# EAGLE design tetris_fs (EAGLE 8.3.2)
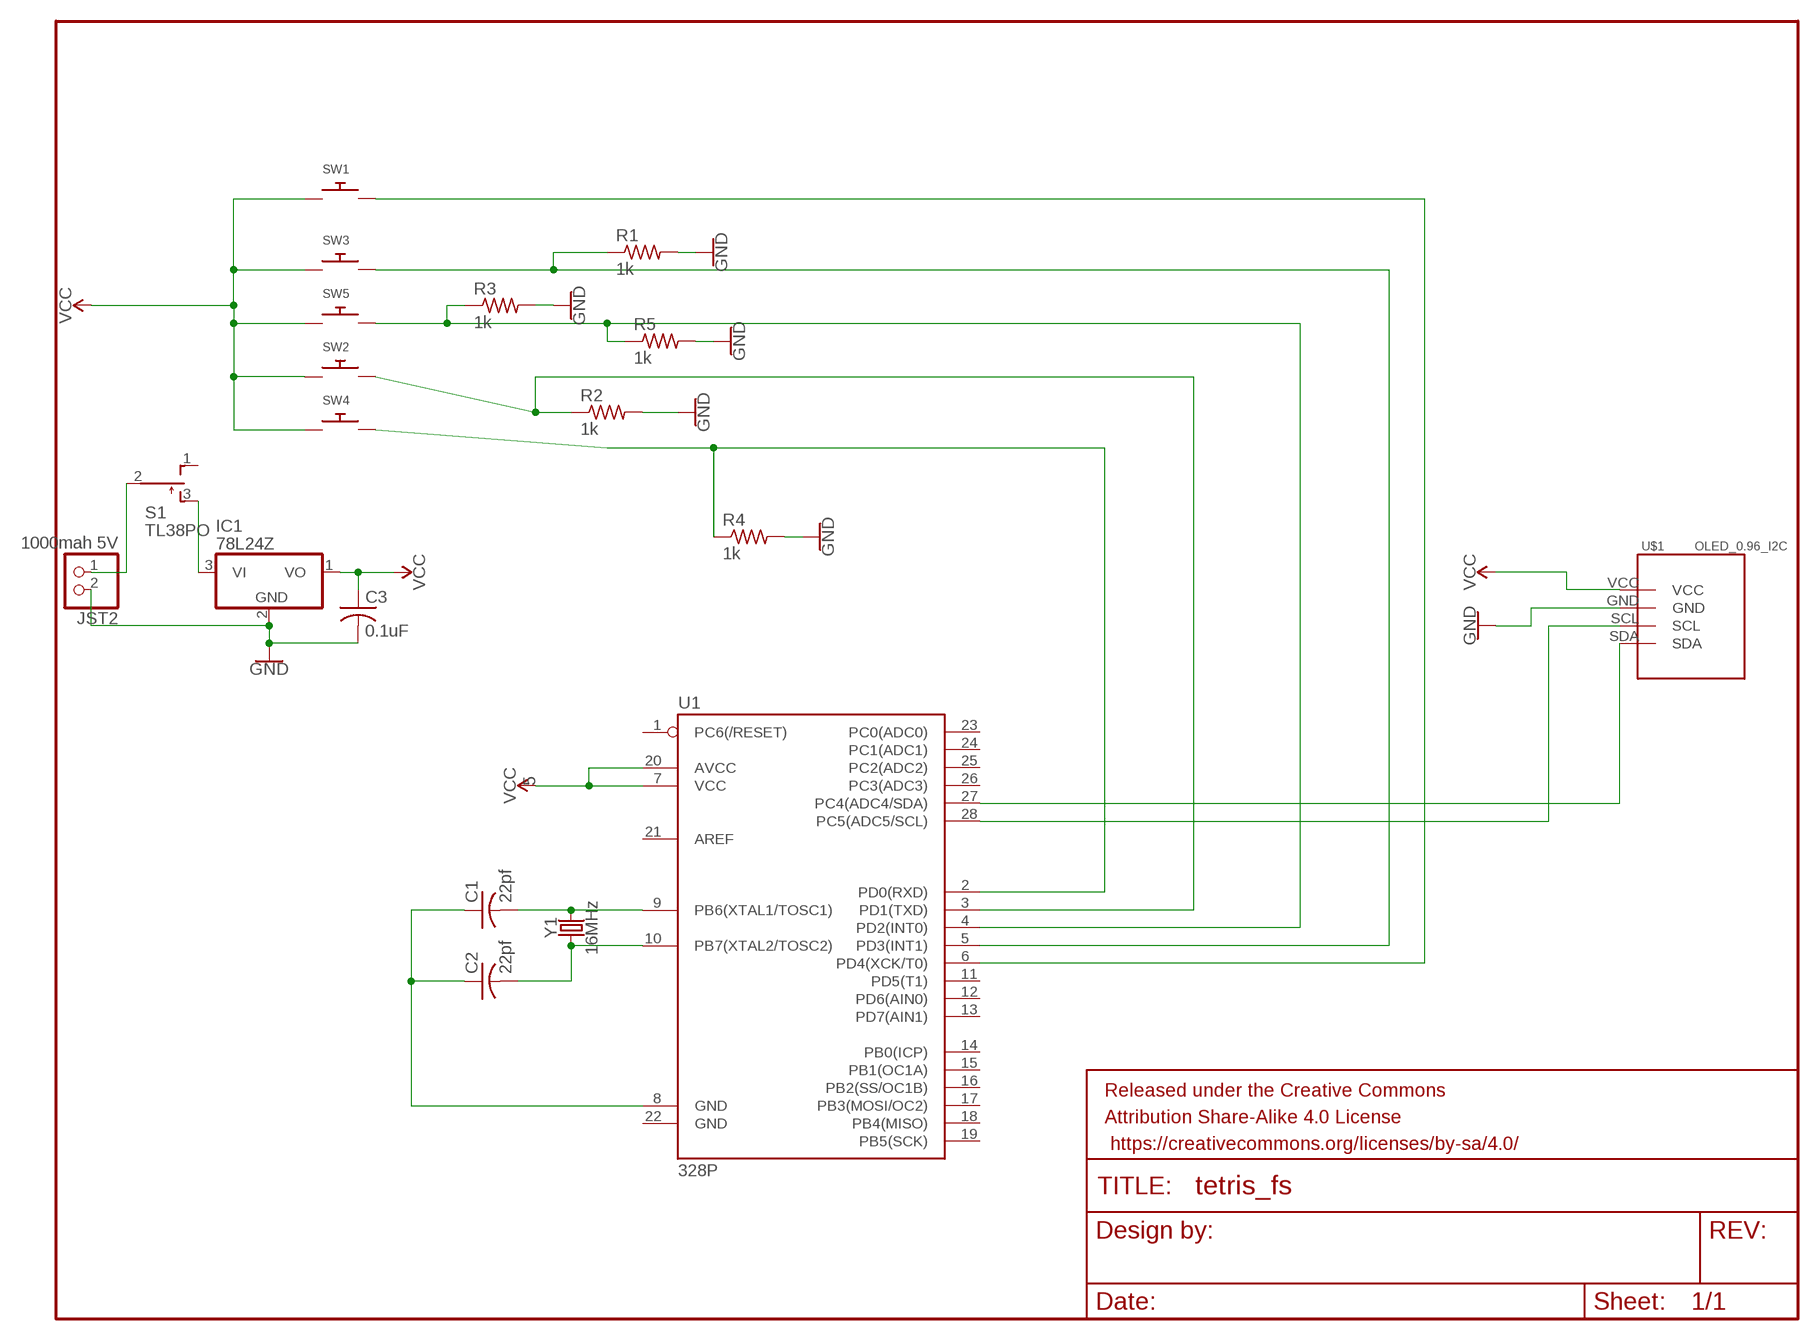
[diagram p0: schematic, sheet 1]

## Parts
C1  22pf  C-US050-030X075  [C050-030X075]
C2  22pf  C-US050-030X075  [C050-030X075]
C3  0.1uF  C-US050-030X075  [C050-030X075]
FRAME1  FRAME-LETTERNO_PACKAGE  [DUMMY]
IC1  78L24Z  [TO92]
JST2  1000mah 5V  JST_2PIN-SMT-RA  [JST-PH-2-SMT-RA]
R1  1k  R-US_FLIPFLOP  [0805-THM]
R2  1k  R-US_FLIPFLOP  [0805-THM]
R3  1k  R-US_FLIPFLOP  [0805-THM]
R4  1k  R-US_FLIPFLOP  [0805-THM]
R5  1k  R-US_FLIPFLOP  [0805-THM]
S1  TL38PO  [TL3XPO]
SW1  SWITCH_PUSHBUTTONC&K_KSS  [BTN_CK_KSS]
SW2  SWITCH_PUSHBUTTONC&K_KSS  [BTN_CK_KSS]
SW3  SWITCH_PUSHBUTTONC&K_KSS  [BTN_CK_KSS]
SW4  SWITCH_PUSHBUTTONC&K_KSS  [BTN_CK_KSS]
SW5  SWITCH_PUSHBUTTONC&K_KSS  [BTN_CK_KSS]
U1  328P  ATMEGA328P_PDIP  [DIP28]
U$1  OLED_0.96_I2C  [OLED_0.96_I2C]
Y1  16MHz  CRYSTAL-16MHZPTH-HC49US  [HC49US]

## Nets
GND: C3.2 IC1.2(GND) JST2.2 R1.2 R2.2 R3.2 R4.2 R5.2 U$1.GND
N$1: SW1.P$2 U1.6(PD4(XCK/T0))
N$2: R1.1 SW3.P$2 U1.5(PD3(INT1))
N$3: R3.1 R5.1 SW5.P$2 U1.4(PD2(INT0))
N$4: R2.1 SW2.P$2 U1.3(PD1(TXD))
N$5: R4.1 SW4.P$2 U1.2(PD0(RXD))
N$6: C1.2 U1.9(PB6(XTAL1/TOSC1)) Y1.2
N$7: C2.2 U1.10(PB7(XTAL2/TOSC2)) Y1.1
N$8: C1.1 C2.1 U1.8(GND)
N$9: JST2.1 S1.2(P)
N$10: U1.27(PC4(ADC4/SDA)) U$1.SDA
N$11: U1.28(PC5(ADC5/SCL)) U$1.SCL
N$12: IC1.3(VI) S1.3(S)
VCC: C3.1 IC1.1(VO) SW1.P$1 SW2.P$1 SW3.P$1 SW4.P$1 SW5.P$1 U1.7(VCC) U1.20(AVCC) U$1.VCC
Unconnected: S1.1(O) U1.1(PC6(/RESET)) U1.11(PD5(T1)) U1.12(PD6(AIN0)) U1.13(PD7(AIN1)) U1.14(PB0(ICP)) U1.15(PB1(OC1A)) U1.16(PB2(SS/OC1B)) U1.17(PB3(MOSI/OC2)) U1.18(PB4(MISO)) U1.19(PB5(SCK)) U1.21(AREF) U1.22(GND) U1.23(PC0(ADC0)) U1.24(PC1(ADC1)) U1.25(PC2(ADC2)) U1.26(PC3(ADC3))

## Library data of the parts
C1-C3 = adafruit:C-US: CAPACITOR, American symbol
FRAME1 = SparkFun-Aesthetics:FRAME-LETTER: Schematic Frame - Letter Standard 8.5x11 US Letter frame; DESIGNER: Nobody; VERSION: v01
IC1 = adafruit:78*: Positive VOLTAGE REGULATOR Added bigger pads to the TO-92 package
JST2 = adafruit:JST_2PIN: JST 2-Pin Connectors of various flavors SMT-RA (S2B-PH-SM4) 4UConnector #17311 SMT (B2B-PH-SM4) THM-RA (S2B-PH) THM (B2B-PH); VOLTS: 5
R1-R5 = adafruit:R-US_: RESISTOR, American symbol
S1 = switch:TL38PO: TINY SWITCH ON OFF MOM Source: http://www2.produktinfo.conrad.com/datenblaetter/700000-724999/705152-da-01-de-Subminiaturschalter_TL_36YO.pdf
SW1 = adafruit:SWITCH_PUSHBUTTON: Buttons SOFTTOUCHSMD_SJ - Soft touch temporary push button (Super Junk Akihabara) Compatible with SKPMANE010 [Mouser: 688-SKPMAN] C&K_KSS = Digikey: KSS221GLFS; PIN: D4
SW2 = adafruit:SWITCH_PUSHBUTTON: Buttons SOFTTOUCHSMD_SJ - Soft touch temporary push button (Super Junk Akihabara) Compatible with SKPMANE010 [Mouser: 688-SKPMAN] C&K_KSS = Digikey: KSS221GLFS; PIN: D1
SW3 = adafruit:SWITCH_PUSHBUTTON: Buttons SOFTTOUCHSMD_SJ - Soft touch temporary push button (Super Junk Akihabara) Compatible with SKPMANE010 [Mouser: 688-SKPMAN] C&K_KSS = Digikey: KSS221GLFS; PIN: D3
SW4 = adafruit:SWITCH_PUSHBUTTON: Buttons SOFTTOUCHSMD_SJ - Soft touch temporary push button (Super Junk Akihabara) Compatible with SKPMANE010 [Mouser: 688-SKPMAN] C&K_KSS = Digikey: KSS221GLFS; PIN: D0
SW5 = adafruit:SWITCH_PUSHBUTTON: Buttons SOFTTOUCHSMD_SJ - Soft touch temporary push button (Super Junk Akihabara) Compatible with SKPMANE010 [Mouser: 688-SKPMAN] C&K_KSS = Digikey: KSS221GLFS; PIN: D2
U1 = SparkFun-IC-Microcontroller:ATMEGA328P_PDIP: Atmel 328P Through hole ATMEGA328P uC used in the Arduino 32kb flash, 1k EEPROM, 2k SRAM Datasheet <http://www.sparkfun.com/datasheets/Components/SMD/ATMega328.pdf> SparkFun Products Storefront component: AVR 28 Pin 20MHz 32K 6A/D - ATMega328P <https://www.sparkfun.com/products/9061> (COM-09061) SparkFun Simon Says - Through-Hole Soldering Kit <https://www.sparkfun.com/products/10547> (KIT-10547) SparkFun Learn to Solder - Simon Says <https://www.sparkfun.com/products/13708> (KIT-13708) SparkFun BigTime Watch Kit <https://www.sparkfun.com/products/11734> (KIT-11734) SparkFun ClockIt <https://www.sparkfun.com/products/10930> (KIT-10930) SparkFun Serial Enabled LCD Kit <https://www.sparkfun.com/products/10097> (LCD-10097) SparkFun Simon Tilts - Through Hole Soldering Kit <https://www.sparkfun.com/products/12634> (KIT-12634) SparkFun Frequency Counter Kit <https://www.sparkfun.com/products/10140> (KIT-10140) FabFM Radio Kit <https://www.sparkfun.com/products/11043> (KIT-11043) SparkFun Binary Blaster Kit <https://www.sparkfun.com/products/12037> (KIT-12037) SparkFun Metro-Gnome <https://www.sparkfun.com/products/9236> (KIT-09236) ATmega328 with Arduino Optiboot (Uno) <https://www.sparkfun.com/products/10524> (DEV-10524); PROD_ID: IC-09136
U$1 = tft_1.8_1.44_oled_0.96:OLED_0.96_I2C
Y1 = SparkFun-Clocks:CRYSTAL-16MHZ: 16MHz Crystal Digikey Example <http://www.digikey.com/product-search/en?keywords=535-9122-1-ND> Frequency: 16MHz Frequency Stability: ±50ppm Frequency Tolerance: ±20ppm Load Capacitance: 18pF SparkFun Products: Pro Micro -5V/16MHz <https://www.sparkfun.com/products/12640> SparkFun Serial Enabled LCD Kit <https://www.sparkfun.com/products/10097>; PROD_ID: XTAL-08181; SF_ID: COM-00536

## Board
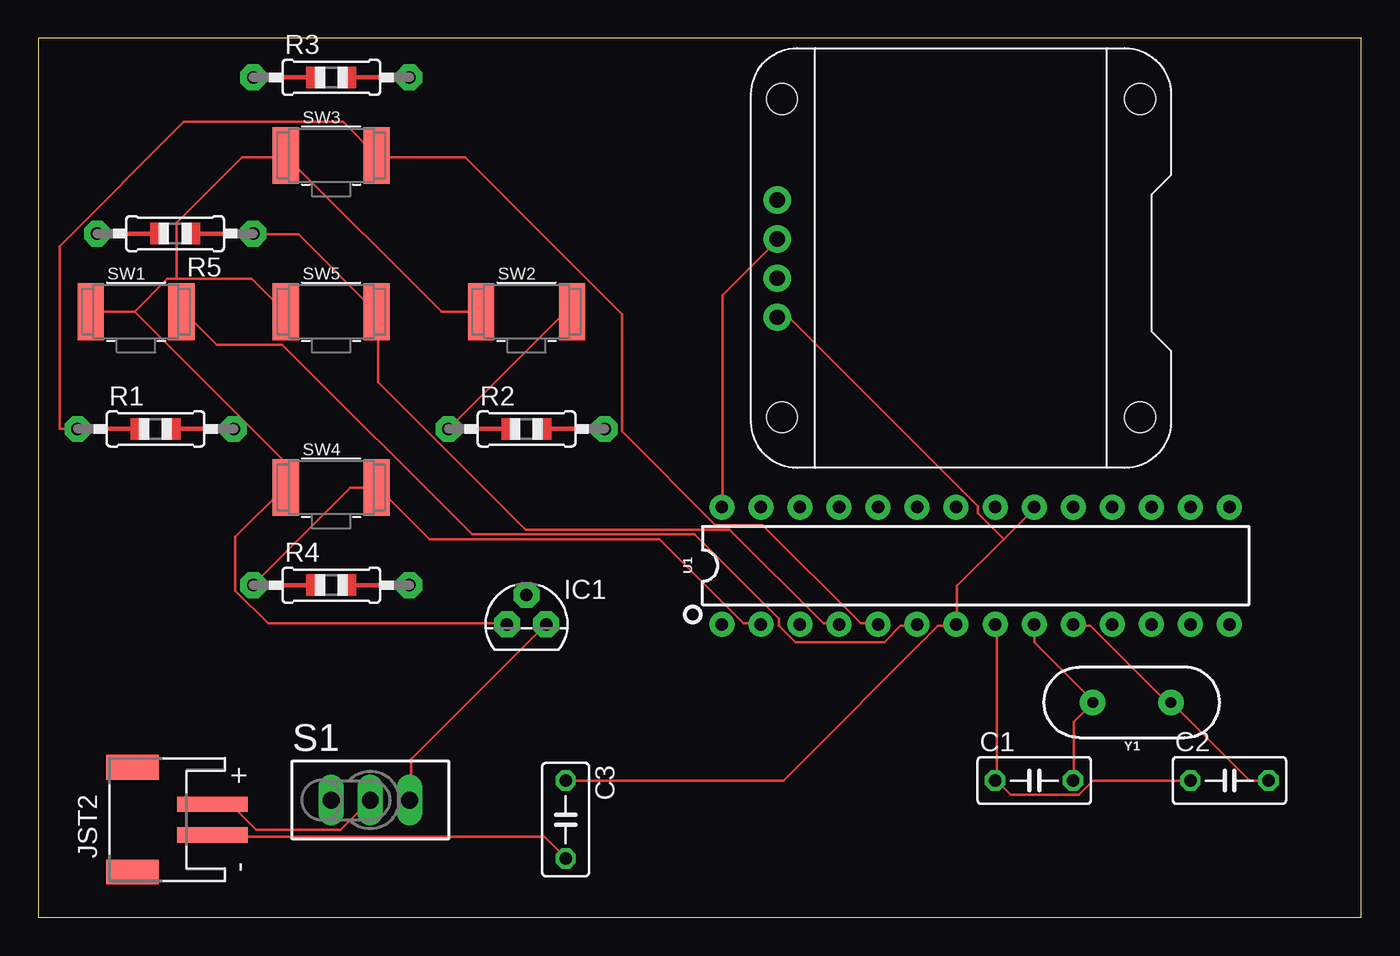
[diagram p1: board, top side]
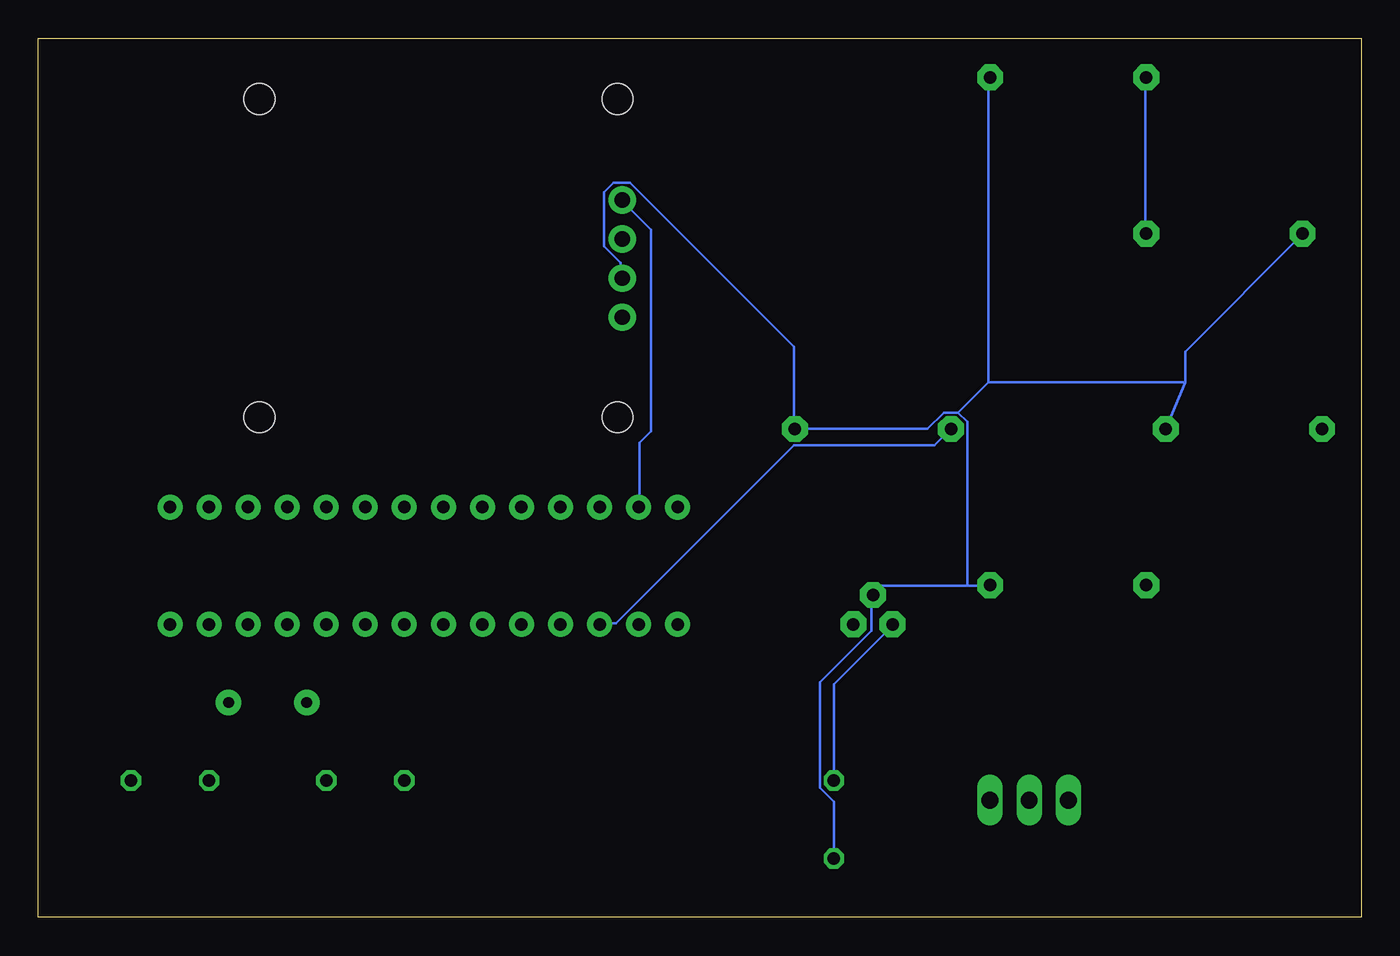
[diagram p2: board, bottom side, seen from below]

Size 86.03 x 57.14 mm. Coordinates in mm from the lower left corner, seen from the top.
Outline: 0,0 86.03,0 86.03,57.14 0,57.14 0,0
Copper layers (1*16): Top 0.035mm / dielectric 1.5mm / Bottom 0.035mm
Design rules "default": minimum track width 6mil, minimum drill 0.35mm, track to track 6mil, track to pad 6mil, pad to pad 6mil, via to via 6mil, smd to smd 6mil, copper to edge 40mil, drill to drill 6mil, minimum pad ring 10mil, minimum via ring 8mil, stop-mask expansion 4mil, vias tented up to drill 0mil, thermal gap 10mil

### Footprints (pad centres in the part's own frame; a part is rotated, then mirrored left to right if it is on the bottom)
C050-030X075 = drill 0.813 octagon: 1 -2.54,0; 2 2.54,0
TO92 = drill 0.813 pad 1.676 octagon: 1 -1.27,0; 2 0,1.905; 3 1.27,0
JST-PH-2-SMT-RA = smd 1 x 4.6: 1 1,-3.7; 2 -1,-3.7 | smd 1.6 x 3.4: NC1 -3.4,1.5; NC2 3.4,1.5
0805-THM = drill 0.813 pad 1.676 octagon: 1 -5.08,0; 2 5.08,0
TL3XPO = drill 1.1 pad 1.422 long: 1 -2.54,0; 2 0,0; 3 2.54,0
BTN_CK_KSS = smd 1.7 x 3.7: P$1 -2.95,0; P$2 2.95,0
DIP28 = drill 0.813 pad 1.626: 1 -16.51,-3.81; 2 -13.97,-3.81; 3 -11.43,-3.81; 4 -8.89,-3.81; 5 -6.35,-3.81; 6 -3.81,-3.81; 7 -1.27,-3.81; 8 1.27,-3.81; 9 3.81,-3.81; 10 6.35,-3.81; 11 8.89,-3.81; 12 11.43,-3.81; 13 13.97,-3.81; 14 16.51,-3.81; 15 16.51,3.81; 16 13.97,3.81; 17 11.43,3.81; 18 8.89,3.81; 19 6.35,3.81; 20 3.81,3.81; 21 1.27,3.81; 22 -1.27,3.81; 23 -3.81,3.81; 24 -6.35,3.81; 25 -8.89,3.81; 26 -11.43,3.81; 27 -13.97,3.81; 28 -16.51,3.81
OLED_0.96_I2C = drill 1 pad 1.778: GND -1.63,11.63; SCL 0.91,11.63; SDA 3.45,11.63; VCC -4.17,11.63 | hole 2: -10.67,-11.97; 10.03,-11.97; 10.03,11.33; -10.67,11.33
HC49US = drill 0.7 pad 1.651: 1 -2.54,0; 2 2.54,0

### Placement (x,y rotation side)
C1  64.77,8.89 0 top
C2  77.47,8.89 0 top
C3  34.29,6.35 270 top
FRAME1  -34.29,76.2 0 top  (outside the outline)
IC1  31.75,19.05 0 top
JST2  7.62,6.35 90 top
R1  7.62,31.75 0 top
R2  31.75,31.75 0 top
R3  19.05,54.61 0 top
R4  19.05,21.59 0 top
R5  8.89,44.45 180 top
S1  21.59,7.62 0 top
SW1  6.35,39.37 0 top
SW2  31.75,39.37 0 top
SW3  19.05,49.53 0 top
SW4  19.05,27.94 0 top
SW5  19.05,39.37 0 top
U1  60.96,22.86 0 top
U$1  59.69,43.18 90 top
Y1  71.12,13.97 180 top

### Tracks (layer width: path | path; a pad name or v marks a point on that pad's centre or on a via)
GND
  Top 0.152: JST2.2 11.43,5.23 32.92,5.23 34.29,3.86 C3.2
  Bottom 0.152: 11.43,34.8 11.43,36.78 3.81,44.4 R5.2 | 11.43,34.8 R1.2 | C3.2 34.29,7.52 35.2,8.43 35.2,15.29 31.85,18.64 31.85,20.93 IC1.2 31.7,21.08 31.24,21.54 25.6,21.54 | 25.6,21.54 24.23,21.54 R4.2 | 26.21,32.82 27.13,32.82 28.19,31.75 R2.2 36.88,31.75 36.88,37.08 47.55,47.75 48.62,47.75 49.23,47.14 49.23,43.64 48.16,42.57 48.16,41.66 U$1.GND | 26.21,32.82 25.6,32.21 25.6,21.54 | 24.23,34.8 24.23,54.61 R3.2 | 26.21,32.82 24.23,34.8 | 24.23,34.8 11.43,34.8
N$1
  Top 0.152: U1.6 57.15,18.95 56.08,18.95 55.02,17.88 49.23,17.88 48.16,18.95 48.16,19.41 42.67,24.89 28.19,24.89 15.85,37.24 11.58,37.24 9.45,39.37 SW1.P$2
N$2
  Top 0.152: U1.5 54.56,19.1 53.49,19.1 47.09,25.5 44.04,25.5 37.95,31.6 37.95,39.22 27.74,49.43 22.1,49.43 SW3.P$2 21.95,49.58 19.81,51.71 9.45,51.71 1.37,43.64 1.37,31.75 R1.1
N$3
  Top 0.152: U1.4 51.97,19.1 51.05,19.1 44.96,25.2 31.7,25.2 22.1,34.8 22.1,39.37 SW5.P$2 21.95,39.37 16.92,44.4 14.02,44.4 R5.1
  Bottom 0.152: R5.1 14.02,44.55 14.02,54.61 R3.1
N$4
  Top 0.152: SW2.P$2 34.29,39.37 R2.1
  Bottom 0.152: R2.1 27.74,30.68 36.88,30.68 48.46,19.1 49.53,19.1 U1.3
N$5
  Top 0.152: U1.2 46.94,19.1 45.87,19.1 40.39,24.59 25.45,24.59 22.1,27.94 SW4.P$2 20.27,27.94 14.02,21.69 R4.1
N$6
  Top 0.152: C1.2 67.36,8.89 67.36,12.7 68.58,13.92 Y1.2 68.58,14.07 64.77,17.88 U1.9
N$7
  Top 0.152: C2.2 78.79,8.89 73.76,13.92 Y1.1 73.61,14.07 73.3,14.07 68.43,18.95 67.36,18.95 U1.10
N$8
  Top 0.152: 62.33,8.89 62.33,18.95 U1.8 | C2.1 68.58,8.89 67.67,7.98 63.25,7.98 62.33,8.89 | 62.33,8.89 C1.1
N$9
  Top 0.152: S1.2 19.66,5.69 14.17,5.69 12.65,7.21 11.43,7.21 JST2.1
N$10
  Bottom 0.152: U1.27 46.94,26.72 46.94,30.84 46.18,31.6 46.18,44.7 48.01,46.53 U$1.SDA
N$11
  Top 0.152: U1.28 44.5,26.72 44.5,40.44 48.01,43.94 U$1.SCL
N$12
  Top 0.152: IC1.3 24.23,10.26 24.23,7.67 S1.3
VCC
  Top 0.152: 62.79,24.59 64.77,26.57 U1.20 | 62.79,24.59 59.74,21.54 59.74,19.1 U1.7 59.59,18.95 58.52,18.95 48.46,8.89 C3.1 | 62.79,24.59 61.11,26.26 61.11,26.72 48.92,38.91 48.16,38.91 U$1.VCC | 6.25,39.37 SW1.P$1 | 6.25,39.37 8.38,41.5 8.99,41.5 | 8.99,41.5 13.87,41.5 16,39.37 SW5.P$1 | 16,27.94 16,29.62 6.25,39.37 | 8.99,41.5 8.99,45.16 13.26,49.43 16,49.43 SW3.P$1 16.15,49.43 26.21,39.37 SW2.P$1 | 16,27.94 12.8,24.74 12.8,21.23 14.93,19.1 30.48,19.1 IC1.1 | 16,27.94 SW4.P$1
  Bottom 0.152: C3.1 34.29,15.14 30.48,18.95 IC1.1